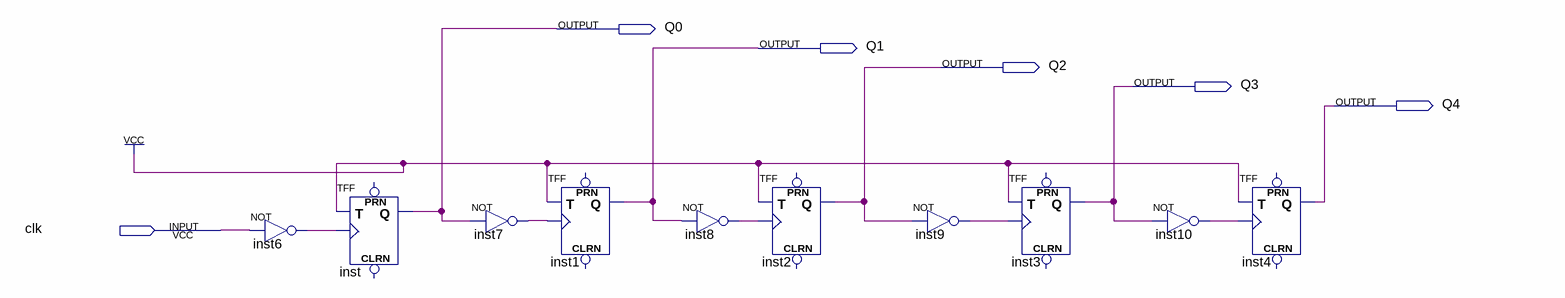
[diagram p0: schematic sheet]
// Quartus schematic T_Counter.bdf as structural Verilog: 10 symbols, 6 pins
module T_Counter (
  input  clk,
  output Q0,
  output Q1,
  output Q2,
  output Q3,
  output Q4
);

  wire inst6_out, inst7_out, inst8_out, inst9_out, inst10_out;

  not inst6 (inst6_out, clk);
  TFF inst (.T(1'b1), .CLK(inst6_out), .Q(Q0));  // open: PRN, CLRN
  not inst7 (inst7_out, Q0);
  TFF inst1 (.T(1'b1), .CLK(inst7_out), .Q(Q1));  // open: PRN, CLRN
  not inst8 (inst8_out, Q1);
  TFF inst2 (.T(1'b1), .CLK(inst8_out), .Q(Q2));  // open: PRN, CLRN
  not inst9 (inst9_out, Q2);
  TFF inst3 (.T(1'b1), .CLK(inst9_out), .Q(Q3));  // open: PRN, CLRN
  not inst10 (inst10_out, Q3);
  TFF inst4 (.T(1'b1), .CLK(inst10_out), .Q(Q4));  // open: PRN, CLRN
endmodule
